# EasyEDA schematic schematic.json
TITLE: Sheet_1; REV: 1.0; Date: 2025-02-13; Sheet: 1/1; Drawn By: tobycm; Company: Your Company
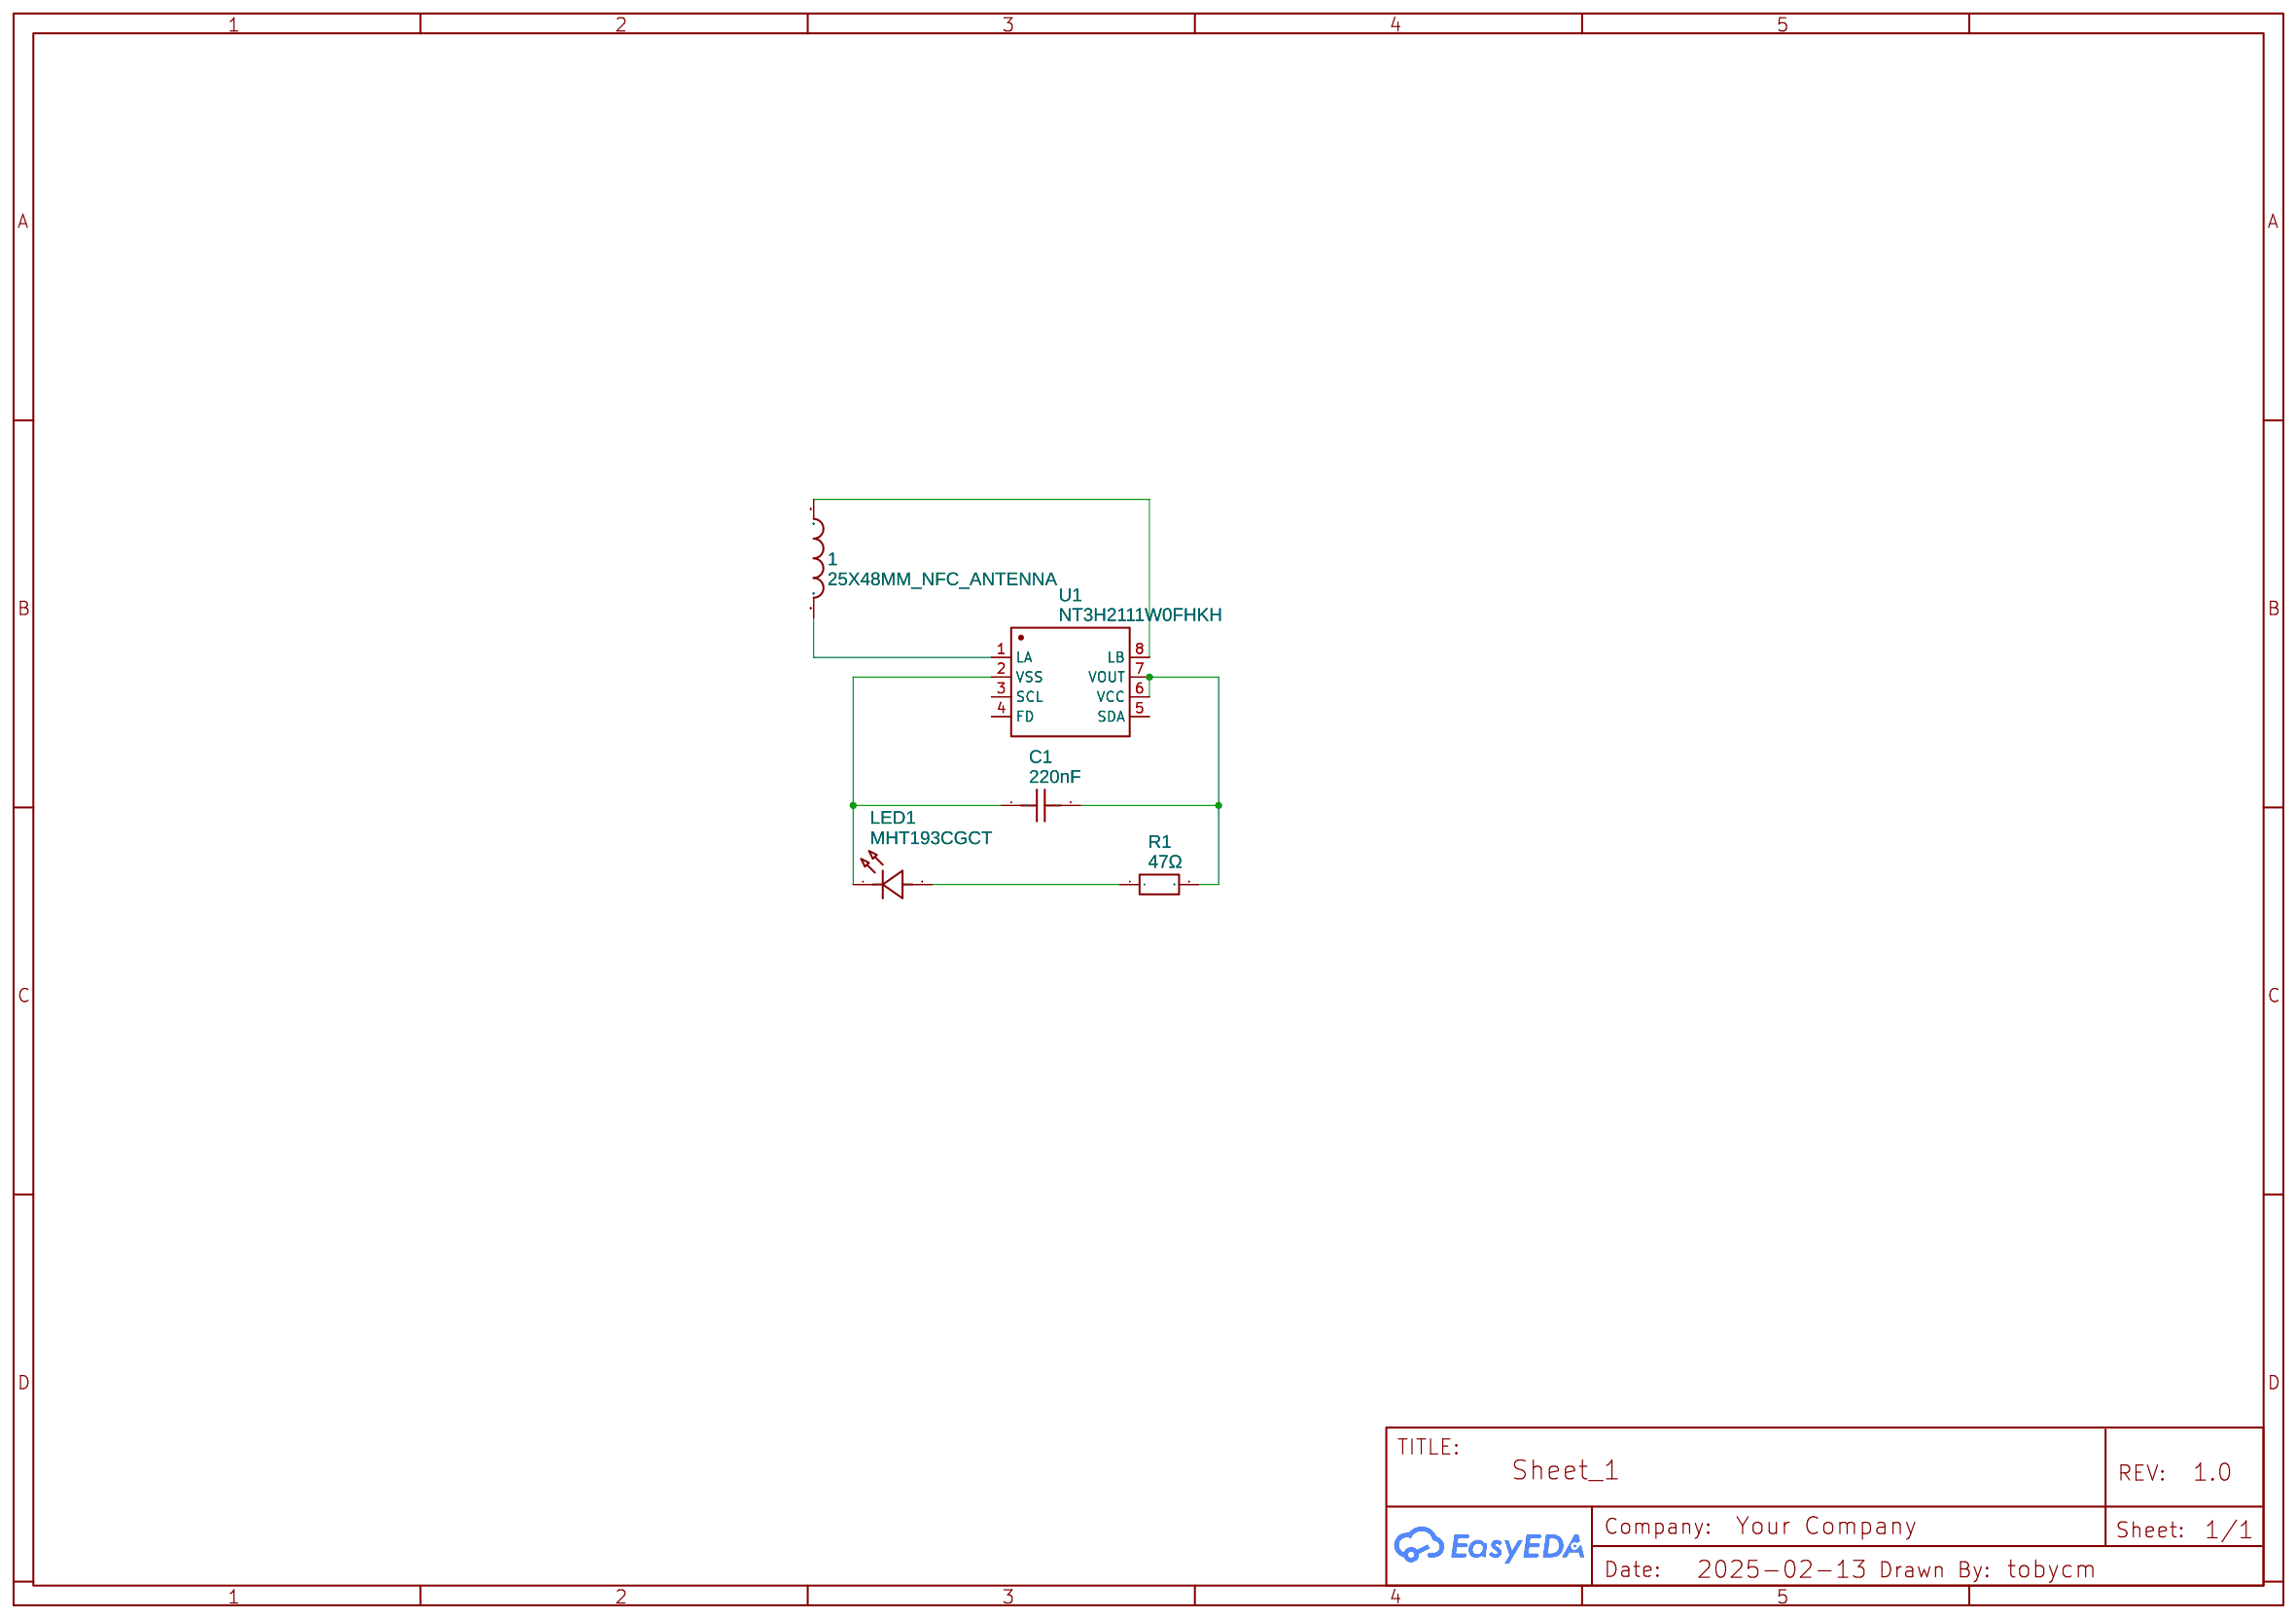
[diagram p0: schematic sheet]

## Parts
1  25X48MM_NFC_ANTENNA  [25X48MM_NFC_ANTENNA]
C1  220nF  [C0603]
LED1  MHT193CGCT  [LED0603-RD_GREEN]
R1  47Ω  [RES-TH_BD2.7-L6.2-P10.20-D0.4]
U1  NT3H2111W0FHKH  [XQFN-8_L1.6-W1.6-P0.50-BL_NT3H2111W0FHKH]

## Library data of the parts
1 = 25X48MM_NFC_ANTENNA: Contributor: dnonoo
C1 = CC0603KRX5R7BB224: Contributor: lcsc; Supplier: LCSC; Supplier Part: C576841; Manufacturer: YAGEO(国巨); JLCPCB Part Class: Extended Part
LED1 = MHT193CGCT: Contributor: lcsc; Supplier: LCSC; Supplier Part: C2962098; Manufacturer: MEIHUA(美华); JLCPCB Part Class: Extended Part
R1 = MO1/4W-47Ω±5%-ST52: Contributor: lcsc; Supplier: LCSC; Supplier Part: C2857430; Manufacturer: VO(翔胜); JLCPCB Part Class: Extended Part
U1 = NT3H2111W0FHKH: Contributor: LCSC; Supplier: LCSC; Supplier Part: C710403; Manufacturer: NXP(恩智浦); JLCPCB Part Class: Extended Part

## Nets
Net-(1-P$1): 1.P$1 U1.8(LB)
Net-(1-P$2): 1.P$2 U1.1(LA)
Net-(C1-1): C1.1 LED1.1(K) U1.2(VSS)
Net-(C1-2): C1.2 R1.2 U1.6(VCC) U1.7(VOUT)
Net-(LED1-2): LED1.2(A) R1.1

Not connected (* = marked no-connect by the designer): U1 3(SCL) 4(FD) 5(SDA)
